# EAGLE design KP01RGB (EAGLE 7.1.0)

## Sheet 1 of 2
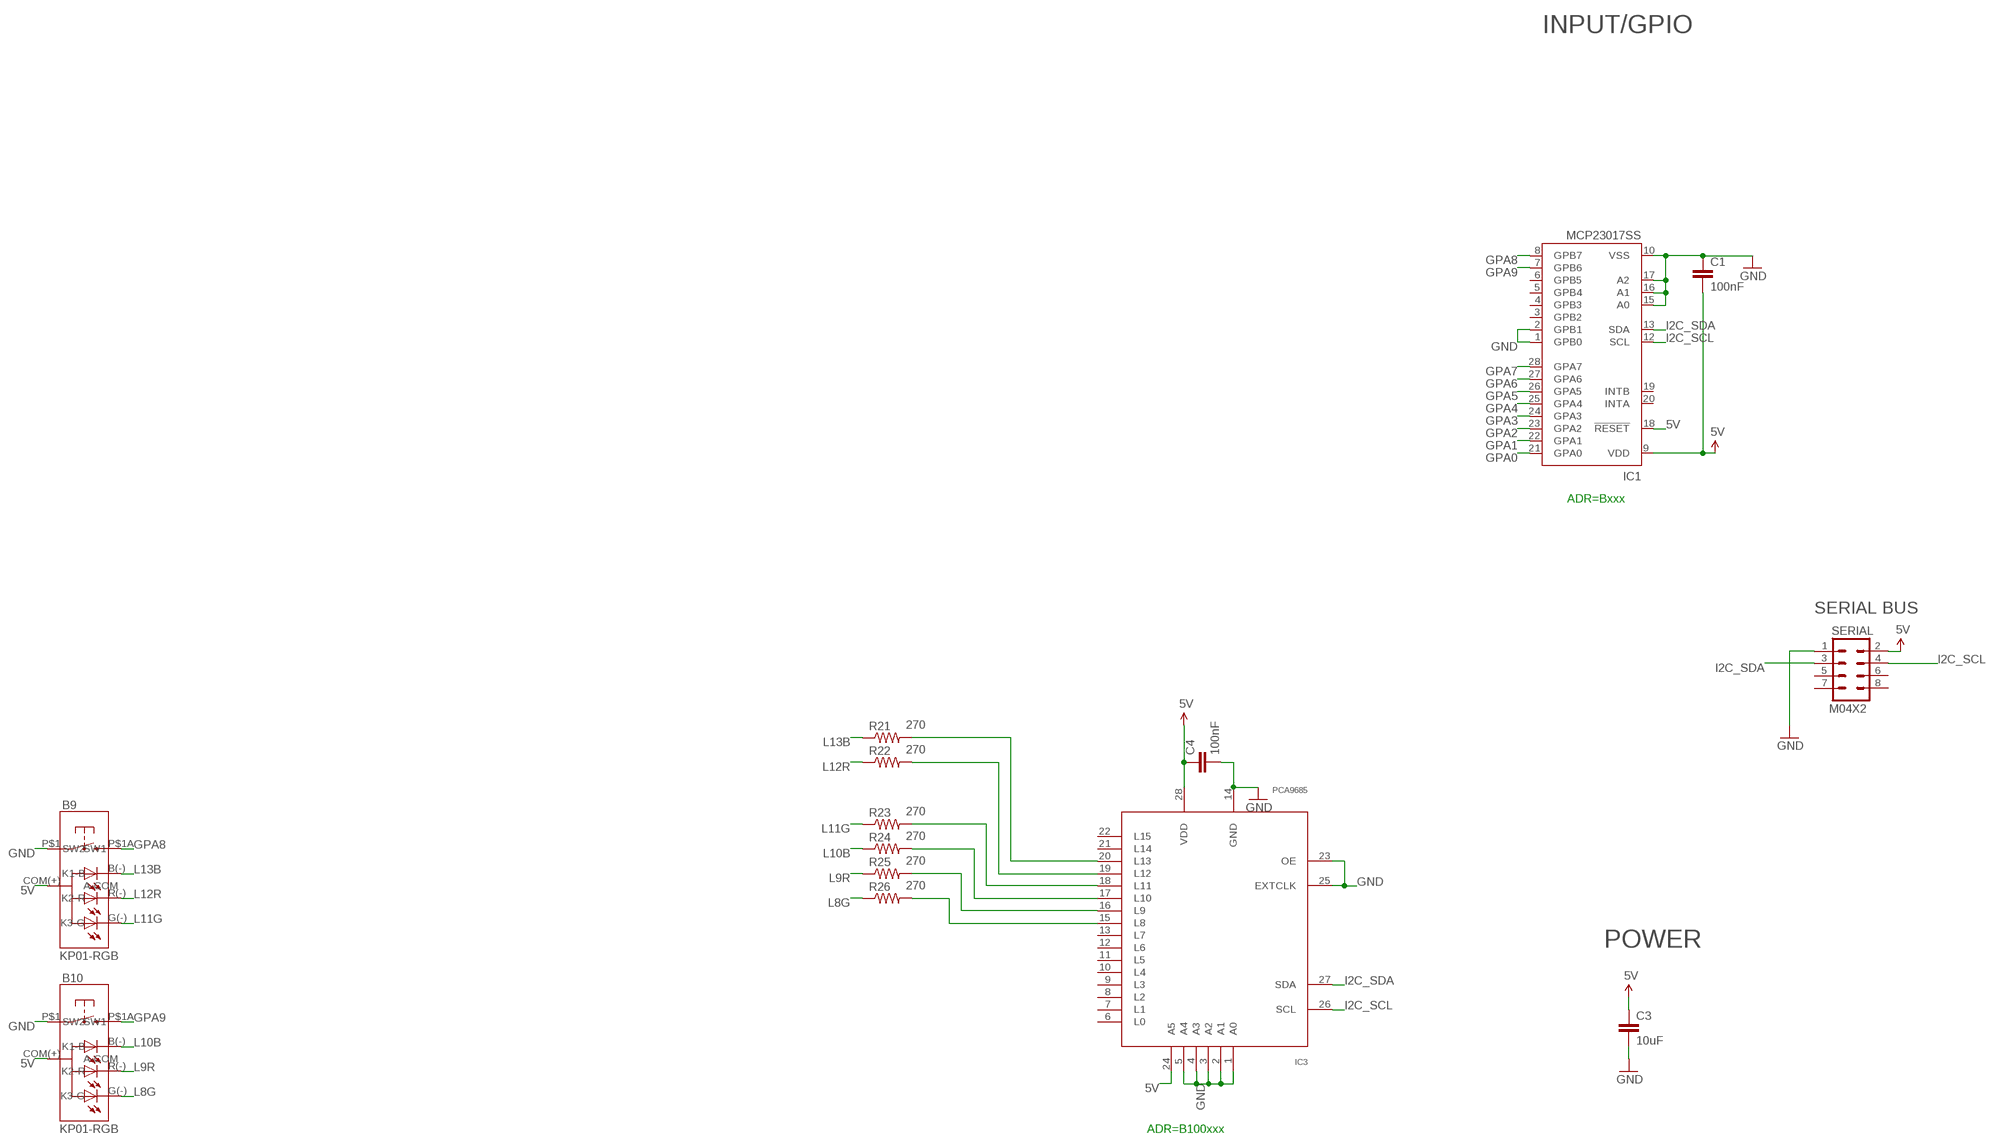
[diagram p0: schematic, sheet 1]

### Parts
B9  KP01-RGB  NKK-KP01  [NKK-KP01]
B10  KP01-RGB  NKK-KP01  [NKK-KP01]
C1  100nF  CAP0603-CAP  [0603-CAP]
C3  10uF  CAP0805  [0805]
C4  100nF  CAP0603-CAP  [0603-CAP]
IC1  MCP23017SS  [SSOP28]
IC3  PCA9685  [TSSOP28]
R21  270  RESISTOR0603-RES  [0603-RES]
R22  270  RESISTOR0603-RES  [0603-RES]
R23  270  RESISTOR0603-RES  [0603-RES]
R24  270  RESISTOR0603-RES  [0603-RES]
R25  270  RESISTOR0603-RES  [0603-RES]
R26  270  RESISTOR0603-RES  [0603-RES]
SERIAL  M04X2  [2X4]

### Nets
5V [Power]: B9.COM(+)(A-COM) B10.COM(+)(A-COM) C1.2 C3.1 C4.1 IC1.9(VDD) IC1.18(!RESET) IC3.24(A5) IC3.28(VDD) SERIAL.2
GND [Power]: B9.P$1(SW1) B10.P$1(SW1) C1.1 C3.2 C4.2 IC1.1(GPB0) IC1.2(GPB1) IC1.10(VSS) IC1.15(A0) IC1.16(A1) IC1.17(A2) IC3.1(A0) IC3.2(A1) IC3.3(A2) IC3.4(A3) IC3.5(A4) IC3.14(GND) IC3.23(OE) IC3.25(EXTCLK) SERIAL.1
GPA0: IC1.21(GPA0)
GPA1: IC1.22(GPA1)
GPA2: IC1.23(GPA2)
GPA3: IC1.24(GPA3)
GPA4: IC1.25(GPA4)
GPA5: IC1.26(GPA5)
GPA6: IC1.27(GPA6)
GPA7: IC1.28(GPA7)
GPA8: B9.P$1A(SW2) IC1.8(GPB7)
GPA9: B10.P$1A(SW2) IC1.7(GPB6)
I2C_SCL: IC1.12(SCL) IC3.26(SCL) SERIAL.4
I2C_SDA: IC1.13(SDA) IC3.27(SDA) SERIAL.3
L8G: B10.G(-)(K3-G) R26.1
L9R: B10.R(-)(K2-R) R25.1
L10B: B10.B(-)(K1-B) R24.1
L11G: B9.G(-)(K3-G) R23.1
L12R: B9.R(-)(K2-R) R22.1
L13B: B9.B(-)(K1-B) R21.1
N$18: IC3.15(L8) R26.2
N$28: IC3.16(L9) R25.2
N$29: IC3.17(L10) R24.2
N$30: IC3.18(L11) R23.2
N$31: IC3.19(L12) R22.2
N$32: IC3.20(L13) R21.2
Unconnected: IC1.3(GPB2) IC1.4(GPB3) IC1.5(GPB4) IC1.6(GPB5) IC1.19(INTB) IC1.20(INTA) IC3.6(L0) IC3.7(L1) IC3.8(L2) IC3.9(L3) IC3.10(L4) IC3.11(L5) IC3.12(L6) IC3.13(L7) IC3.21(L14) IC3.22(L15) SERIAL.5 SERIAL.6 SERIAL.7 SERIAL.8

### Notes on the sheet
- INPUT/GPIO
- ADR=Bxxx
- SERIAL BUS
- POWER
- ADR=B100xxx

## Sheet 2 of 2

## Library data of the parts
B9 B10 = SKAARHOJ:NKK-KP01: NKK-KP01-15AC 100mA12VDC
C1 C3 C4 = SparkFun:CAP: Capacitor Standard 0603 ceramic capacitor, and 0.1" leaded capacitor.
IC1 = microchip:MCP23017: http://ww1.microchip.com/downloads/en/DeviceDoc/21952a.pdf Source: http://ww1.microchip.com/downloads/en/DeviceDoc/21952a.pdf; MF: MICROCHIP; MPN: MCP23017-E/SS; OC_FARNELL: 1467674; OC_NEWARK: 31K2960
IC3 = wsmith:PCA9685
R21-R26 = SparkFun:RESISTOR: Resistor Basic schematic elements and footprints for 0603, 1206, and PTH resistors.
SERIAL = SparkFun:M04X2

## Net classes
0 default: width 0.152 mm, drill 0.254 mm, clearance 0.152 mm
1 Power: width 0.406 mm, drill 0.61 mm, clearance 0.203 mm

## Board
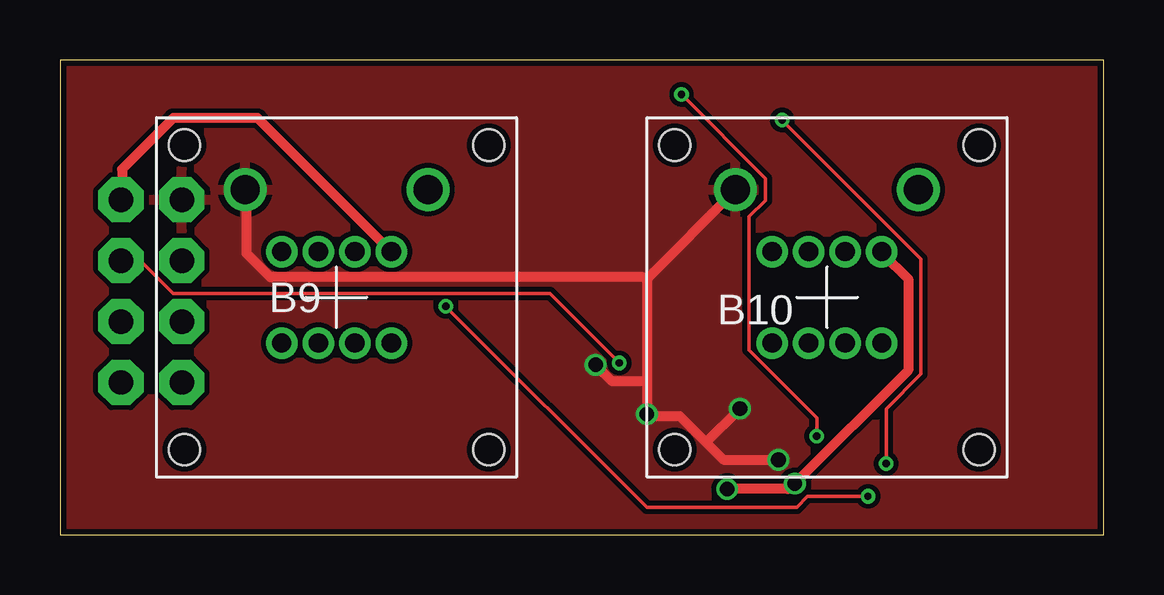
[diagram p1: board, top side]
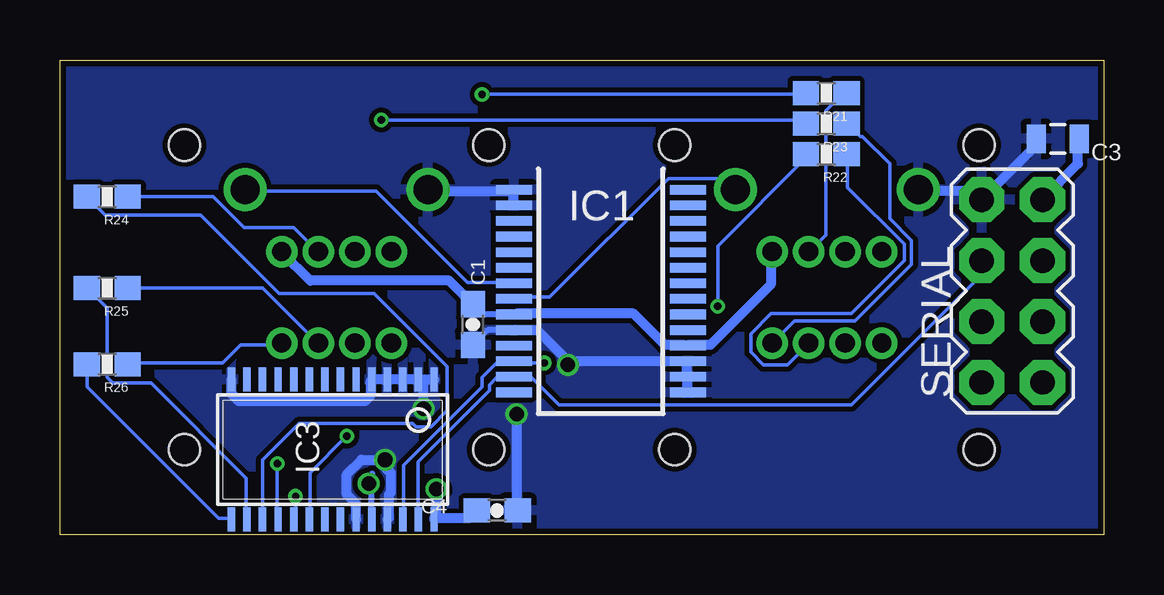
[diagram p2: board, bottom side, seen from below]

Size 43.5 x 19.8 mm. Coordinates in mm from the lower left corner, seen from the top.
Outline: 0,0 43.5,0 43.5,19.8 0,19.8 0,0
Copper layers (1*16): Top 0.035mm / dielectric 1.5mm / Bottom 0.035mm
Design rules "Fusion_eagle_rule_v1.1": minimum track width 6mil, minimum drill 12mil, track to track 6mil, track to pad 6mil, pad to pad 6mil, via to via 6mil, smd to smd 0mil, copper to edge 10mil, drill to drill 10mil, minimum pad ring 10mil, minimum via ring 6mil, stop-mask expansion 2mil, vias tented up to drill 100mil, thermal gap 10mil

### Footprints (pad centres in the part's own frame; a part is rotated, then mirrored left to right if it is on the bottom)
NKK-KP01 = drill 0.8: B(-) 1.905,-0.762; COM(+) 1.905,-2.286; G(-) -1.905,-2.286; P$3 1.905,0.762; P$4 1.905,2.286; P$7 -1.905,0.762; P$8 -1.905,2.286; R(-) -1.905,-0.762 | drill 1.2: P$1 4.496,3.81; P$1A 4.496,-3.81 | hole 1.3: -6.35,6.35; 6.35,6.35; 6.35,-6.35; -6.35,-6.35
0603-CAP = smd 1.1 x 1: 1 -0.85,0; 2 0.85,0
0805 = smd 0.8 x 1.2: 1 -0.9,0; 2 0.9,0
SSOP28 = smd 0.4 x 1.5: 1 -4.225,-3.625; 2 -3.575,-3.625; 3 -2.925,-3.625; 4 -2.275,-3.625; 5 -1.625,-3.625; 6 -0.975,-3.625; 7 -0.325,-3.625; 8 0.325,-3.625; 9 0.975,-3.625; 10 1.625,-3.625; 11 2.275,-3.625; 12 2.925,-3.625; 13 3.575,-3.625; 14 4.225,-3.625; 15 4.225,3.625; 16 3.575,3.625; 17 2.925,3.625; 18 2.275,3.625; 19 1.625,3.625; 20 0.975,3.625; 21 0.325,3.625; 22 -0.325,3.625; 23 -0.975,3.625; 24 -1.625,3.625; 25 -2.275,3.625; 26 -2.925,3.625; 27 -3.575,3.625; 28 -4.225,3.625
TSSOP28 = smd 0.305 x 0.991: 1 -4.225,-2.918; 2 -3.575,-2.918; 3 -2.925,-2.918; 4 -2.275,-2.918; 5 -1.625,-2.918; 6 -0.975,-2.918; 7 -0.325,-2.918; 8 0.325,-2.918; 9 0.975,-2.918; 10 1.625,-2.918; 11 2.275,-2.918; 12 2.925,-2.918; 13 3.575,-2.918; 14 4.225,-2.918; 15 4.225,2.918; 16 3.575,2.918; 17 2.925,2.918; 18 2.275,2.918; 19 1.625,2.918; 20 0.975,2.918; 21 0.325,2.918; 22 -0.325,2.918; 23 -0.975,2.918; 24 -1.625,2.918; 25 -2.275,2.918; 26 -2.925,2.918; 27 -3.575,2.918; 28 -4.225,2.918
0603-RES = smd 1.1 x 1: 1 -0.85,0; 2 0.85,0
2X4 = drill 1.016 pad 1.88 octagon: 1 -3.81,-1.27; 2 -3.81,1.27; 3 -1.27,-1.27; 4 -1.27,1.27; 5 1.27,-1.27; 6 1.27,1.27; 7 3.81,-1.27; 8 3.81,1.27

### Placement (x,y rotation side)
B9  11.53,9.9 90 top
B10  31.97,9.9 90 top
C1  26.29,8.76 90 bottom
C3  1.91,16.51 180 bottom
C4  25.27,1.02 0 bottom
IC1  20.95,10.16 270 bottom
IC3  32.13,3.56 180 bottom
R21  11.56,18.41 180 bottom
R22  11.56,15.88 180 bottom
R23  11.56,17.14 180 bottom
R24  41.53,14.1 180 bottom
R25  41.53,10.29 180 bottom
R26  41.53,7.11 180 bottom
SERIAL  3.81,10.16 270 bottom

### Tracks (layer width: path | path; a pad name or v marks a point on that pad's centre or on a via)
5V  (via drill 0.61)
  Top 0.406: B10.COM(+) 34.29,11.73 35.36,10.67 35.36,6.86 v30.63,2.13 30.48,2.06 30.33,1.91 v27.81,1.91 | SERIAL.2 2.59,14.02 2.59,15.24 4.72,17.37 8.23,17.37 13.79,11.81 B9.COM(+)
  Bottom 0.254: IC1.9 25.86,9.19 C1.2 | IC3.24 30.51,2.13 30.51,2.51 arc90 30.48,2.54
  Bottom 0.406: C4.1 26.14,0.99 26.44,0.69 27.89,0.69 IC3.28 27.81,0.84 v27.81,1.91 | v30.63,2.13 30.51,2.13 | C3.1 1.07,16.46 1.07,15.47 2.52,14.02 SERIAL.2 | B9.COM(+) 13.87,11.73 13.87,10.44 16.38,7.92 17.3,7.92 IC1.18 17.53,7.92 18.29,7.92 19.58,9.22 24.46,9.22 IC1.9 | B10.COM(+) 34.21,11.73 33.07,10.59 27.28,10.59 26.36,9.68 C1.2
GND  (via drill 0.61)
  Top 0.406: 24.46,10.67 24.46,6.4 | 24.46,6.4 v24.46,5.03 24.61,4.95 25.83,4.95 26.94,3.85 | 24.46,10.67 28.12,14.33 B10.P$1 | v29.95,3.12 27.66,3.12 26.94,3.85 | 26.94,3.85 v28.35,5.26 | v22.33,7.09 23.01,6.4 24.46,6.4 | B9.P$1 7.77,14.33 7.77,11.73 8.76,10.74 24.31,10.74 24.46,10.67
  Bottom 0.254: IC1.10 25.67,8.54 C1.1
  Bottom 0.406: C3.2 2.82,16.46 2.82,16.23 SERIAL.1 5.26,14.02 5.56,14.33 7.7,14.33 B9.P$1 | IC1.15 17.37,5.94 17.37,6.55 IC1.16 17.37,6.78 17.37,7.16 IC1.17 17.53,7.24 22.33,7.24 | 22.33,7.24 23.62,8.53 24.46,8.53 IC1.10 | 28.35,6.48 28.5,6.48 IC3.2 28.73,6.48 29.18,6.48 IC3.3 29.34,6.48 29.79,6.48 IC3.4 30.02,6.48 30.48,6.48 IC3.5 30.56,6.33 30.56,5.79 30.79,5.56 36.04,5.56 36.35,5.87 36.35,6.4 IC3.14 | 28.35,6.48 27.96,6.48 IC3.1 | 30.06,2.93 30.25,3.12 30.94,3.12 31.55,2.52 31.55,1.68 31.17,1.29 31.17,0.69 IC3.23 | 30.06,2.93 29.72,2.59 29.72,1.75 29.79,1.68 29.79,0.69 IC3.25 | IC1.2 24.61,13.79 24.61,14.33 IC1.1 24.77,14.33 28.12,14.33 B10.P$1 | v24.46,5.03 24.46,1.07 C4.2 | v29.95,3.12 29.95,3.05 30.06,2.93 | v28.35,5.26 28.35,6.48 | v22.33,7.09 22.33,7.24
  pour Top: 0,0 43.18,0 43.18,20.32 0,20.32
  pour Bottom: 0,0 43.18,0 43.18,20.32 0,20.32
GPA8
  Bottom 0.152: IC1.8 24.54,9.91 23.09,9.91 18.14,14.86 15.85,14.86 15.39,14.4 B9.P$1A
GPA9
  Bottom 0.152: IC1.7 24.61,10.52 26.52,10.52 30.33,14.33 35.74,14.33 B10.P$1A
I2C_SCL  (via drill 0.3)
  Top 0.152: SERIAL.4 3.35,11.43 4.72,10.06 20.42,10.06 v23.32,7.16
  Bottom 0.152: IC3.26 29.18,0.69 29.18,2.9 25.91,6.17 25.91,6.55 25.3,7.16 24.61,7.16 IC1.12 24.54,7.16 v23.32,7.16
I2C_SDA
  Bottom 0.152: IC3.27 28.57,0.69 28.57,3.05 25.6,6.02 25.6,6.25 25.3,6.55 24.61,6.55 IC1.13 24.54,6.55 23.85,6.55 22.71,5.41 10.52,5.41 5.11,10.82 5.11,11.43 SERIAL.3
L8G
  Bottom 0.152: R26.1 40.62,7.16 36.73,7.16 35.97,7.92 34.29,7.92 B10.G(-)
L9R
  Bottom 0.152: R25.1 35.05,10.29 32.77,8 B10.R(-)
L10B
  Bottom 0.152: R24.1 37.11,14.1 35.81,12.8 33.76,12.8 32.77,11.81 B10.B(-)
L11G
  Bottom 0.152: R23.1 10.67,17.14 10.13,16.61 10.06,16.61 8.91,15.47 8.91,13.18 8,12.27 8,11.28 10.36,8.91 12.88,8.91 13.79,8 B9.G(-)
L12R
  Bottom 0.152: R22.1 10.67,15.85 10.67,14.48 8.31,12.12 8.31,11.43 10.52,9.22 13.87,9.22 14.71,8.38 14.71,7.62 14.17,7.09 13.18,7.09 12.34,7.92 B9.R(-)
L13B
  Bottom 0.152: R21.1 10.74,18.36 10.9,18.36 11.58,17.68 11.58,12.5 12.27,11.81 B9.B(-)
N$18
  Bottom 0.152: IC3.15 36.42,0.69 36.88,0.69 42.37,6.17 42.37,7.09 R26.2
N$28
  Bottom 0.152: IC3.16 35.74,0.69 35.74,2.36 39.7,6.33 41.3,6.33 41.53,6.55 41.53,9.45 42.37,10.29 R25.2
N$29
  Bottom 0.152: IC3.17 35.05,0.69 35.05,3.12 33.53,4.65 28.8,4.65 28.65,4.5 28.04,4.5 27.36,5.18 27.36,7.01 30.4,10.06 34.37,10.06 37.64,13.34 41.6,13.34 42.37,14.1 R24.2
N$30  (via drill 0.3)
  Top 0.152: v34.44,2.97 34.44,5.26 35.89,6.71 35.89,11.51 v30.1,17.3
  Bottom 0.152: v34.44,2.97 34.44,0.69 IC3.18 | v30.1,17.3 12.57,17.3 R23.2
N$31  (via drill 0.3)
  Top 0.152: v33.68,1.6 31.17,1.6 30.71,1.14 24.46,1.14 v16.08,9.53
  Bottom 0.152: v33.68,1.6 33.68,0.69 IC3.19 | v16.08,9.53 16.08,12.04 12.42,15.7 12.42,15.85 R22.2
N$32  (via drill 0.3)
  Top 0.152: v31.55,4.12 31.55,4.88 28.73,7.7 28.73,13.26 29.41,13.95 29.41,14.86 v25.91,18.36
  Bottom 0.152: v31.55,4.12 33.07,2.59 33.07,0.69 IC3.20 | v25.91,18.36 12.42,18.36 R21.2